# EAGLE schematic untitled (EAGLE 9.3.1)
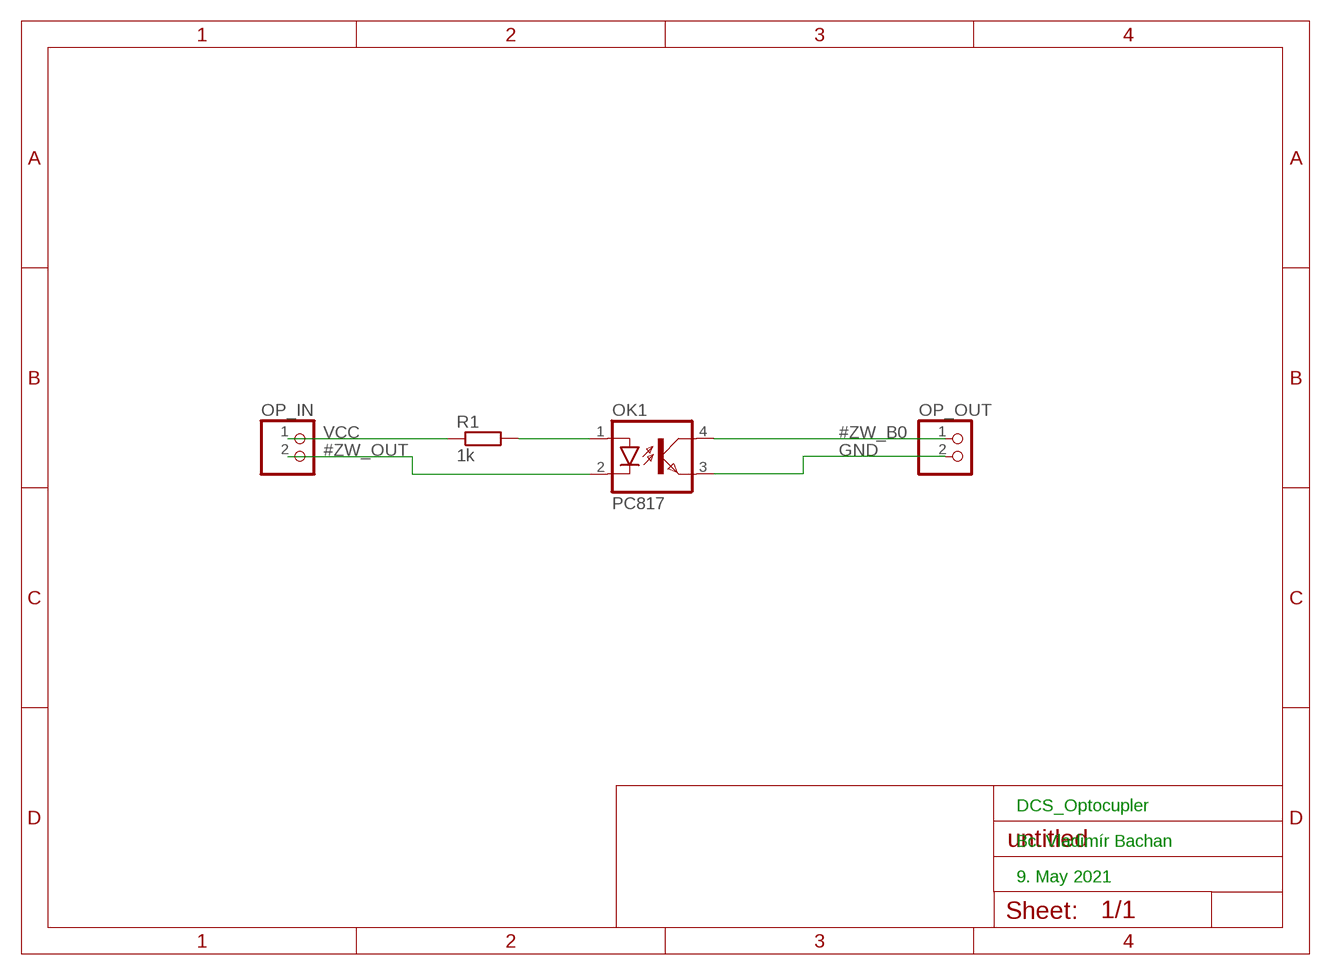
[diagram p0: schematic, sheet 1]

## Parts
OK1  PC817  [DIL04]
OP_IN  PINHD-1X2  [1X02]
OP_OUT  PINHD-1X2  [1X02]
R1  1k  R-EU_0207/10  [0207/10]

## Nets
#ZW_B0: OK1.4(COL) OP_OUT.1
#ZW_OUT: OK1.2(C) OP_IN.2
GND: OK1.3(EMIT) OP_OUT.2
N$3: OK1.1(A) R1.2
VCC: OP_IN.1 R1.1

## Notes on the sheet
- DCS_Optocupler
- Bc. Vladimír Bachan
- 9. May 2021

## Library data of the parts
OK1 = optocoupler:PC817: SHARP OPTO COUPLER; MPN: PC817X4J000F; OC_FARNELL: 9707727; OC_NEWARK: 97K7059
OP_IN OP_OUT = pinhead:PINHD-1X2: PIN HEADER
R1 = rcl:R-EU_: RESISTOR, European symbol; SPICEPREFIX: R